# EAGLE schematic v.1.0_electrode (EAGLE 9.4.2)
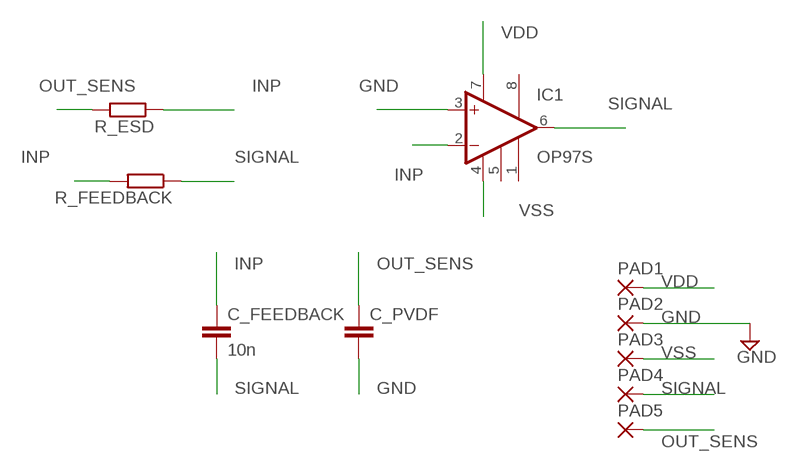
[diagram p0: schematic, sheet 1]

## Parts
C_FEEDBACK  10n  C-EUC0805  [C0805]
C_PVDF  C-EUC0805  [C0805]
IC1  OP97S  [SO08]
PAD1  SMD5  [SMD2,54-5,08]
PAD2  SMD5  [SMD2,54-5,08]
PAD3  SMD5  [SMD2,54-5,08]
PAD4  SMD5  [SMD2,54-5,08]
PAD5  SMD5  [SMD2,54-5,08]
R_ESD  10k  R-EU_M0805  [M0805]
R_FEEDBACK  100M  R-EU_M0805  [M0805]

## Nets
GND: C_PVDF.2 IC1.3(+IN) PAD2.1(P)
INP: C_FEEDBACK.1 IC1.2(-IN) R_ESD.1 R_FEEDBACK.2
OUT_SENS: C_PVDF.1 PAD5.1(P) R_ESD.2
SIGNAL: C_FEEDBACK.2 IC1.6(OUT) PAD4.1(P) R_FEEDBACK.1
VDD: IC1.7(V+) PAD1.1(P)
VSS: IC1.4(V-) PAD3.1(P)
Unconnected: IC1.1(BAL1) IC1.5(COMP) IC1.8(BAL2)

## Library data of the parts
C_FEEDBACK C_PVDF = rcl:C-EU: CAPACITOR, European symbol; SPICEPREFIX: C
IC1 = linear:OP97: Low Power, High Precision Operational Amplifier Source: http://www.analog.com/static/imported-files/data_sheets/OP97.pdf
PAD1-PAD5 = wirepad:SMD5: SMD PAD
R_ESD R_FEEDBACK = rcl:R-EU_: RESISTOR, European symbol; SPICEPREFIX: R